# EAGLE design FanControl (EAGLE 7.7.0)
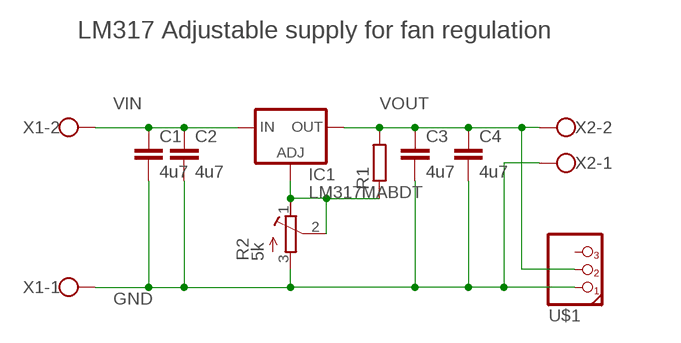
[diagram p0: schematic, sheet 1]

## Parts
C1  4u7  C-EUC0805  [C0805]
C2  4u7  C-EUC0805  [C0805]
C3  4u7  C-EUC0805  [C0805]
C4  4u7  C-EUC0805  [C0805]
IC1  LM317MABDT  [DPACK]
R1  R-EU_R1206  [R1206]
R2  5k  R-TRIMMT93YA  [RTRIMT93YA]
U$1  PINHD-1X3  [1X03]
X1  SCREWTERMINATOR1X2  [W237-102]
X2  SCREWTERMINATOR1X2  [W237-102]

## Nets
GND: C1.2 C2.2 C3.2 C4.2 R2.3(A) U$1.1 X1.1 X2.1
N$5: IC1.1(ADJ) R1.1 R2.1(E) R2.2(S)
VIN: C1.1 C2.1 IC1.3(IN) X1.2
VOUT: C3.1 C4.1 IC1.4(OUT) R1.2 U$1.2 X2.2
Unconnected: U$1.3

## Notes on the sheet
- LM317 Adjustable supply for fan regulation

## Library data of the parts
C1-C4 = rcl:C-EU: CAPACITOR, European symbol
IC1 = v-reg:LM317?*: 500 mA Adjustable Output Positive Voltage Regulator Source: http://www.onsemi.co.jp .. LM317M-D.PDF
R1 = rcl:R-EU_: RESISTOR, European symbol
R2 = rcl:R-TRIMM: Trimm resistor
U$1 = MyLib:PINHD-1X3
X1 X2 = MyLib:SCREWTERMINATOR1X2: WAGO SCREW CLAMP; MPN: 237-102; OC_FARNELL: unknown; OC_NEWARK: 70K9898

## Board
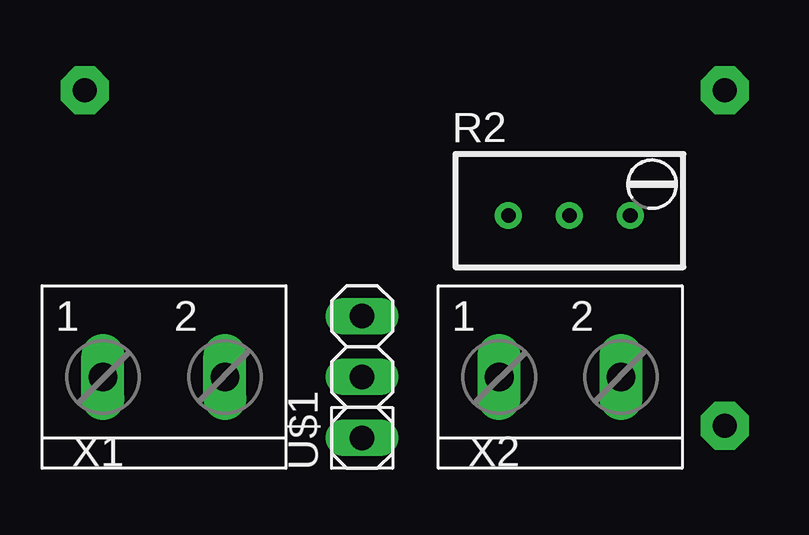
[diagram p1: board, top side]
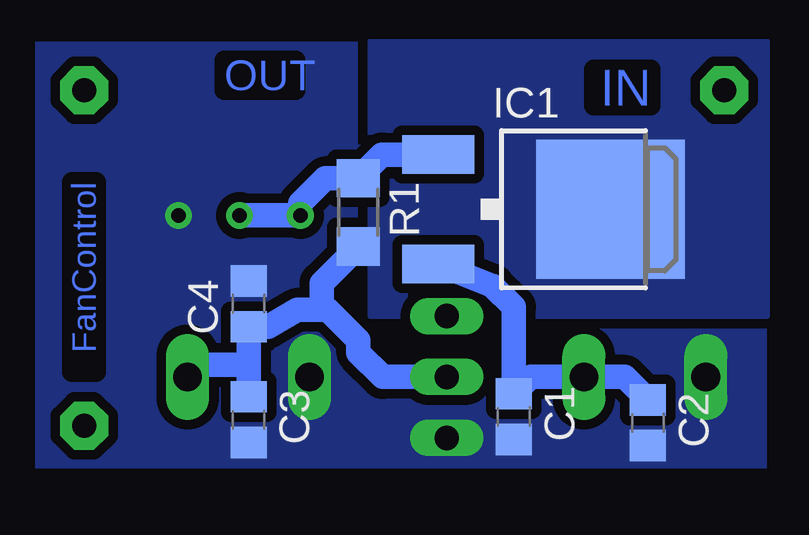
[diagram p2: board, bottom side, seen from below]

No outline drawn. Coordinates in mm, seen from the top.
Copper layers (1*16): Top 0.035mm / dielectric 1.5mm / Bottom 0.035mm
Design rules "default": minimum track width 10mil, minimum drill 24mil, track to track 8mil, track to pad 8mil, pad to pad 8mil, via to via 8mil, smd to smd 8mil, copper to edge 40mil, drill to drill 8mil, minimum pad ring 10mil, minimum via ring 8mil, stop-mask expansion 4mil, vias tented up to drill 0mil, thermal gap 10mil

### Footprints (pad centres in the part's own frame; a part is rotated, then mirrored left to right if it is on the bottom)
C0805 = smd 1.3 x 1.5: 1 -0.95,0; 2 0.95,0
DPACK = smd 1.6 x 3: 1 -2.28,-4.8; 3 2.28,-4.8 | smd 5.8 x 6.2: 4 0,2.38
R1206 = smd 1.6 x 1.803: 1 -1.422,0; 2 1.422,0
RTRIMT93YA = drill 0.61: 1 0,-2.54; 2 0,0; 3 0,2.54
1X03 = drill 1.016 long: 1 -2.54,0; 2 0,0; 3 2.54,0
W237-102 = drill 1.194 long: 1 -2.54,-1.27; 2 2.54,-1.27

### Placement (x,y rotation side)
C1  10.54,2.16 270 bottom
C2  4.95,1.91 270 bottom
C3  21.59,2.03 270 bottom
C4  21.59,6.86 90 bottom
IC1  8.89,10.79 270 bottom
R1  17.02,10.67 270 bottom
R2  21.97,10.54 270 top
U$1  13.34,3.81 90 top
X1  5.08,5.08 0 top
X2  21.59,5.08 0 top

### Tracks (layer width: path | path; a pad name or v marks a point on that pad's centre or on a via)
GND
  pour Bottom (isolate 0.406, rank 2, no thermals): 0,0 0,17.78 30.48,17.78 30.48,0
N$1  (via drill 1 pad 2)
  other vias: 1.78,15.75
N$2  (via drill 1 pad 2)
  other vias: 28.45,15.75
N$3  (via drill 1 pad 2)
  other vias: 28.45,1.78
N$5
  Bottom 1.016: R2.2 R2.1 19.43,11.05 18.39,12.09 R1.1 16.03,13.07 IC1.1
VIN
  Bottom 1.016: C2.1 5.91,3.81 X1.2 9.84,3.81 C1.1 10.54,6.73 11.43,7.62 IC1.3
VOUT
  Bottom 1.016: U$1.2 16,3.81 17.02,4.83 17.02,5.33 18.29,6.6 18.54,6.6 | 21.59,4.32 C4.1 20.76,5.91 19.56,6.6 18.54,6.6 | 21.59,4.32 C3.1 | X2.2 23.62,4.32 21.59,4.32 | R1.2 18.54,7.72 18.54,6.6
  pour Bottom (isolate 0.406, no thermals): 0,17.78 0,6.35 16.51,6.35 16.51,17.78

### Text on the board
Bottom: IN | OUT | FanControl